# EAGLE design BAM_Reference_R2_1 (EAGLE 6.6.0)
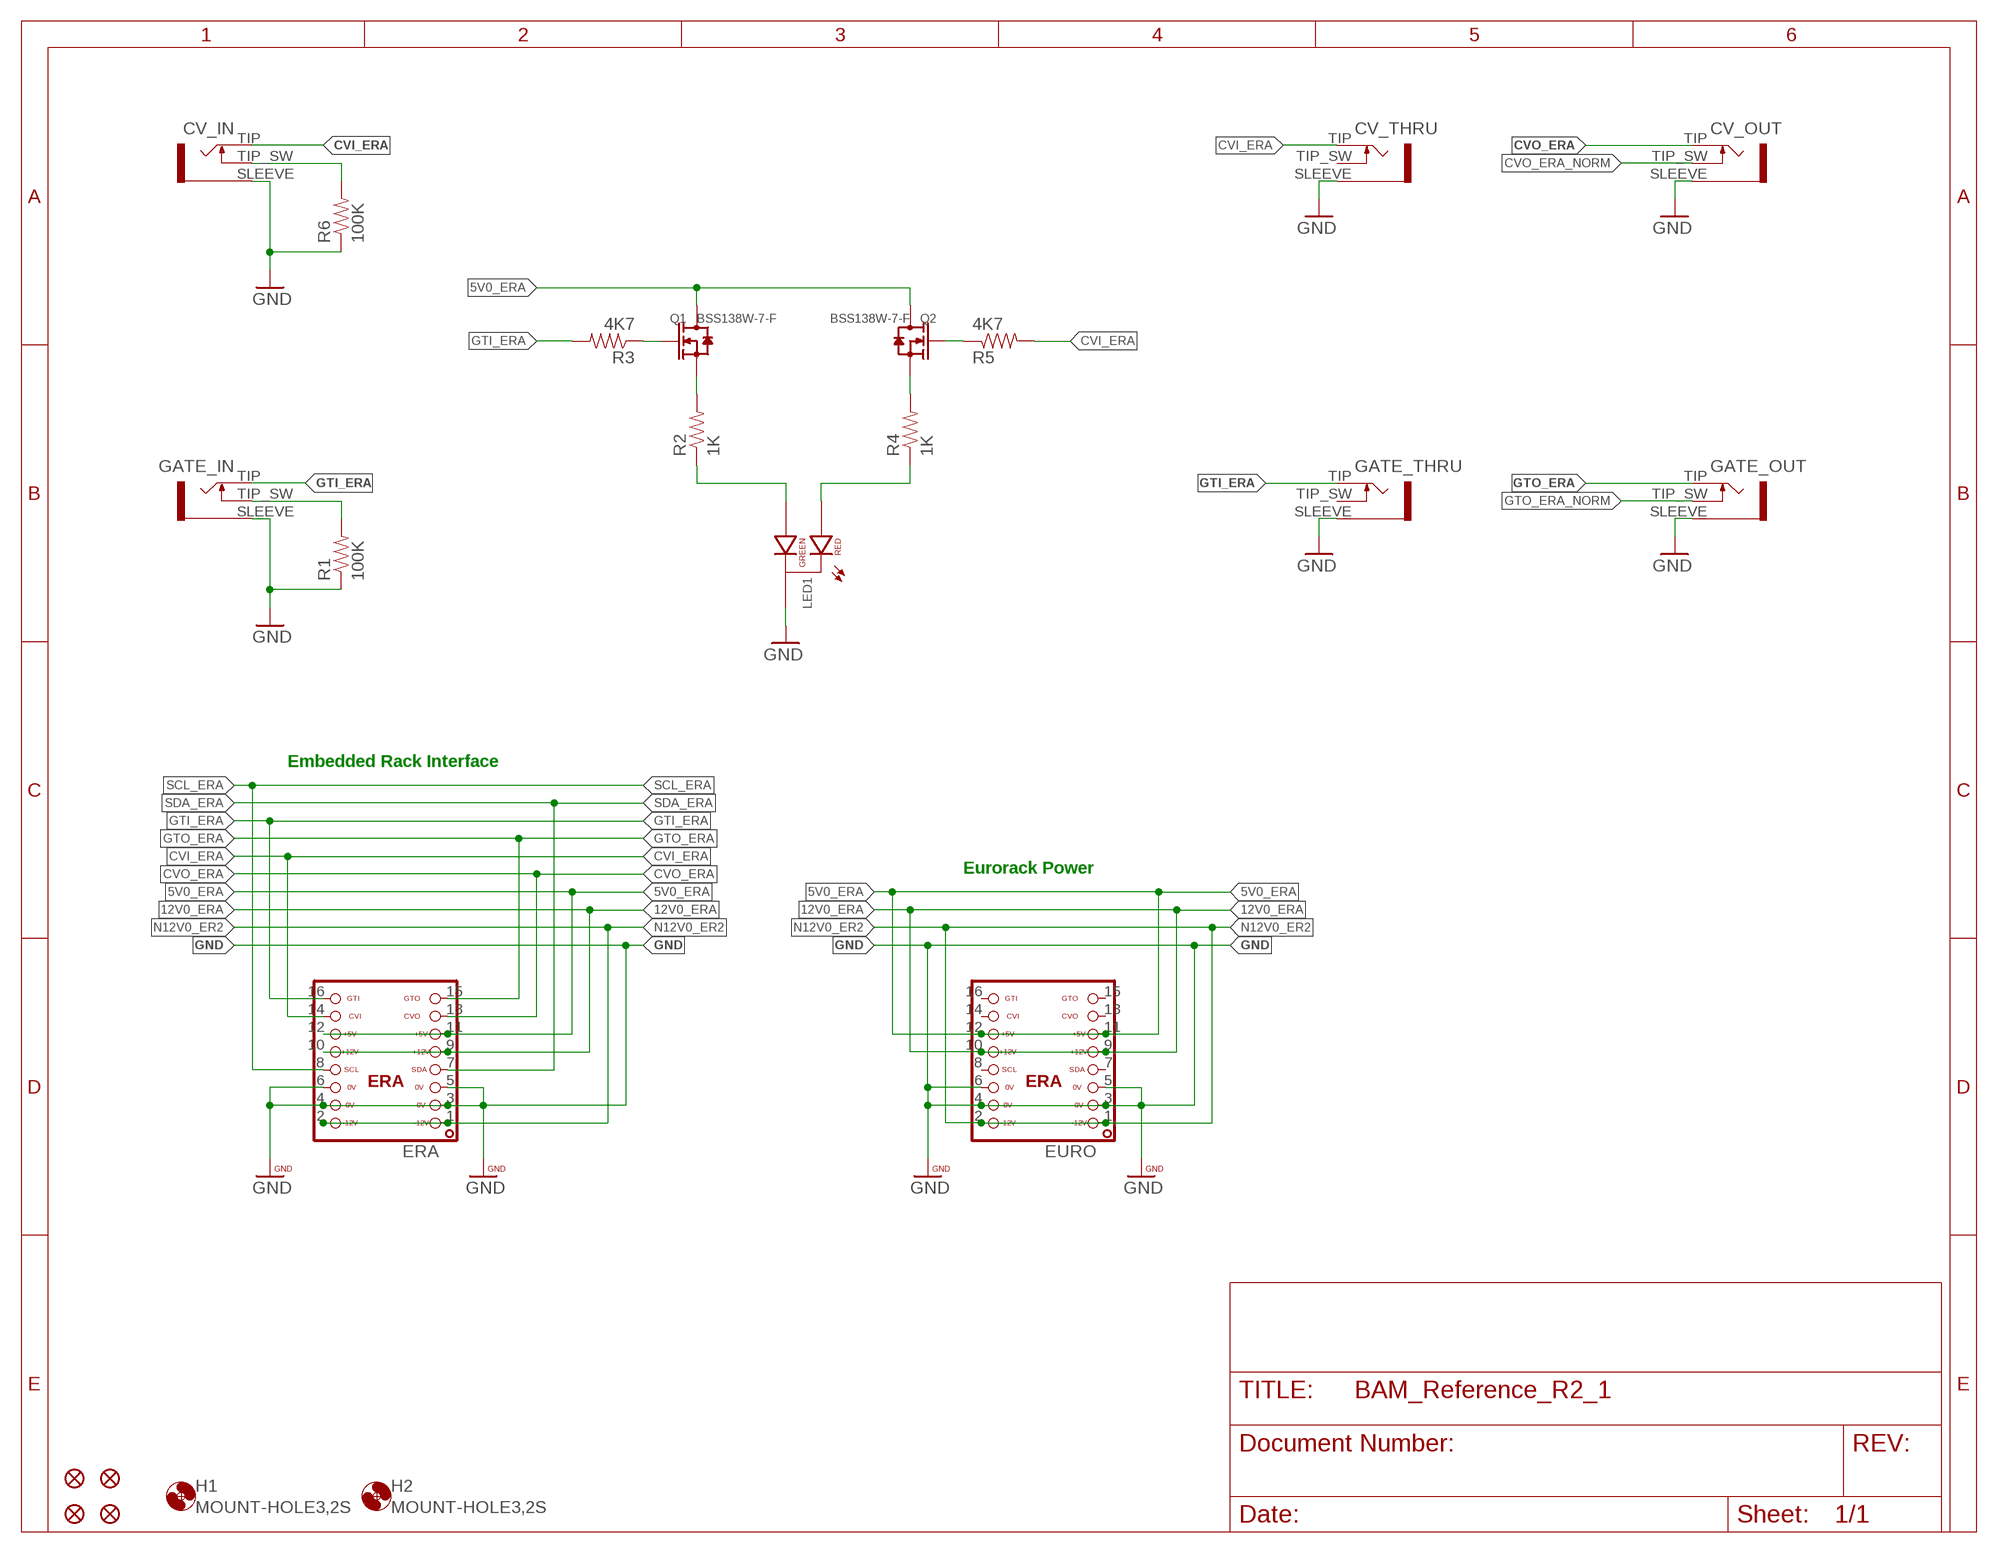
[diagram p0: schematic, sheet 1]

## Parts
CV_IN  JACK-3_5MM-MONO-SW-MJ_3502  [MJ-3502]
CV_OUT  JACK-3_5MM-MONO-SW-MJ_3502  [MJ-3502]
CV_THRU  JACK-3_5MM-MONO-SW-MJ_3502  [MJ-3502]
ERA  ERA-SHROUD  [ERA]
EURO  ERA-SHROUD  [ERA]
FID1  FIDUCIALUFIDUCIAL  [MICRO-FIDUCIAL]
FID2  FIDUCIALUFIDUCIAL  [MICRO-FIDUCIAL]
FID3  FIDUCIALUFIDUCIAL  [MICRO-FIDUCIAL]
FID4  FIDUCIALUFIDUCIAL  [MICRO-FIDUCIAL]
GATE_IN  JACK-3_5MM-MONO-SW-MJ_3502  [MJ-3502]
GATE_OUT  JACK-3_5MM-MONO-SW-MJ_3502  [MJ-3502]
GATE_THRU  JACK-3_5MM-MONO-SW-MJ_3502  [MJ-3502]
H1  MOUNT-HOLE3,2S  [3,2,SMALL]
H2  MOUNT-HOLE3,2S  [3,2,SMALL]
LED1  LED-RG-CC-PTH-G18500  [LED-RG-PANEL]
Q1  BSS138W-7-F  SMD-MOSFET-N-CH-50V-200MA-BSS138W-7-F(SOT-23)  [SOT-23]
Q2  BSS138W-7-F  SMD-MOSFET-N-CH-50V-200MA-BSS138W-7-F(SOT-23)  [SOT-23]
R1  100K  RESISTOR0603  [0603-RES]
R2  1K  RESISTOR0603  [0603-RES]
R3  4K7  RESISTOR0603  [0603-RES]
R4  1K  RESISTOR0603  [0603-RES]
R5  4K7  RESISTOR0603  [0603-RES]
R6  100K  RESISTOR0603  [0603-RES]

## Nets
5V0_ERA: ERA.11 ERA.12 EURO.11 EURO.12 Q1.3(D) Q2.3(D)
12V0_ERA: ERA.9 ERA.10 EURO.9 EURO.10
CVI_ERA: CV_IN.TIP CV_THRU.TIP ERA.14 R5.2
CVO_ERA: CV_OUT.TIP ERA.13
CVO_ERA_NORM: CV_OUT.TIP_SW
GND: CV_IN.SLEEVE CV_OUT.SLEEVE CV_THRU.SLEEVE ERA.3 ERA.4 ERA.5 ERA.6 EURO.3 EURO.4 EURO.5 EURO.6 GATE_IN.SLEEVE GATE_OUT.SLEEVE GATE_THRU.SLEEVE LED1.CC(CATHODE) R1.1 R6.1
GTI_ERA: ERA.16 GATE_IN.TIP GATE_THRU.TIP R3.2
GTO_ERA: ERA.15 GATE_OUT.TIP
GTO_ERA_NORM: GATE_OUT.TIP_SW
N12V0_ER2: ERA.1 ERA.2 EURO.1 EURO.2
N$1: LED1.GREEN(GREEN_CATHODE) R2.1
N$2: LED1.RED(RED_CATHODE) R4.1
N$3: Q1.1(G) R3.1
N$4: Q2.2(S) R4.2
N$5: Q2.1(G) R5.1
N$6: Q1.2(S) R2.2
N$7: CV_IN.TIP_SW R6.2
N$8: GATE_IN.TIP_SW R1.2
SCL_ERA: ERA.8
SDA_ERA: ERA.7
Unconnected: CV_THRU.TIP_SW EURO.7 EURO.8 EURO.13 EURO.14 EURO.15 EURO.16 GATE_THRU.TIP_SW

## Notes on the sheet
- Embedded Rack Interface
- Eurorack Power

## Library data of the parts
CV_IN GATE_IN = oXo_Connectors:JACK-3_5MM-MONO-SW: Jack, 3.5mm, RIght Angle, Though-Hole
CV_OUT CV_THRU GATE_OUT GATE_THRU = halcyonmod_Connectors:JACK-3_5MM-MONO-SW: Jack, 3.5mm, RIght Angle, Though-Hole
ERA EURO = ERA:ERA: EuroRack2 - Backplane Connector
FID1-FID4 = TSOC-ESP8266-BASE:FIDUCIAL: Fiducial Alignment Points Various fiducial points for machine vision alignment.
H1 H2 = oXo_Hardware:MOUNT-HOLE: MOUNTING HOLE with drill center marker
LED1 = halcyonmod_Optoelectronics:LED-RG-CC-PTH: LED Red/Green Common Cathode Pin Through Hole
Q1 Q2 = Seeed-Transistor-2016:SMD-MOSFET-N-CH-50V-200MA-BSS138W-7-F(SOT-23): 305030000; MPN: BSS138W-7-F
R1-R6 = halcyonmod_Passives:RESISTOR: Resistor Basic schematic elements and footprints for 0603, 1206, and PTH resistors.

## Net classes
1 power: width 0.254 mm, drill 0.356 mm, clearance 0.178 mm

## Board
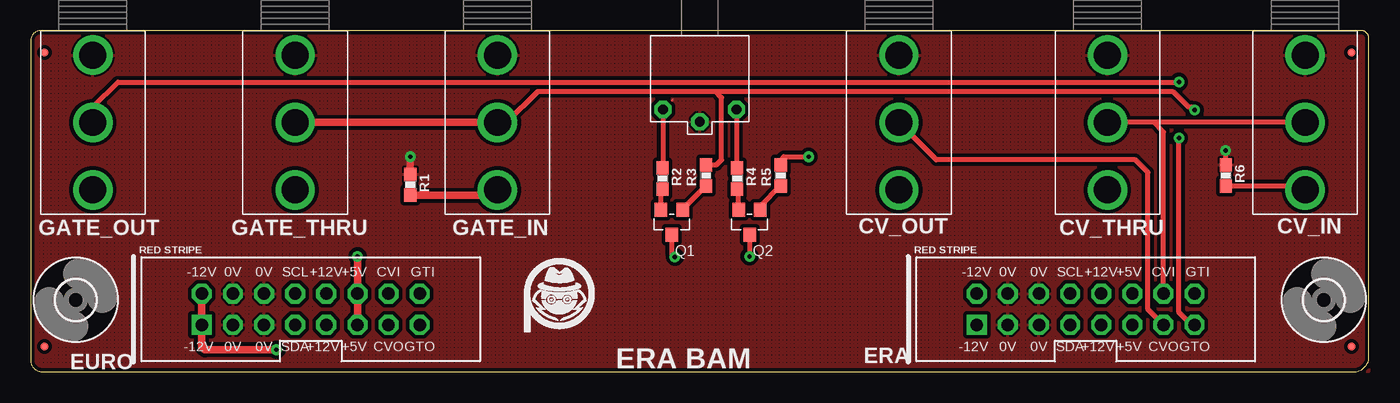
[diagram p1: board, top side]
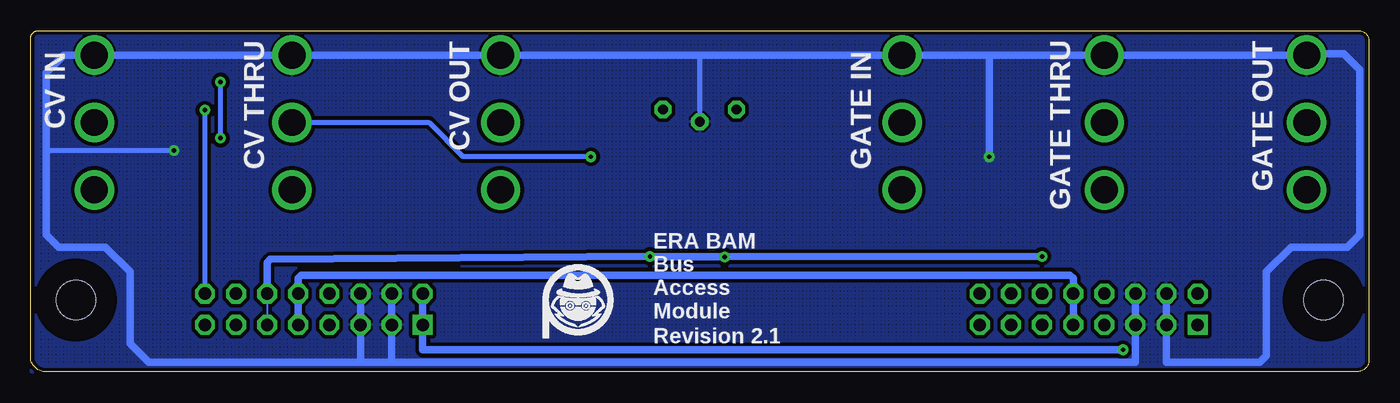
[diagram p2: board, bottom side, seen from below]

Size 109.22 x 27.84 mm. Coordinates in mm from the lower left corner, seen from the top.
Outline: 0.9,0.03 107.72,0.03 arc90 109.22,1.02 109.22,27.2 arc90 108.58,27.84 0.81,27.84 arc90 0,27.03 0,0.92 arc90 0.9,0.03
Copper layers (1*16): Top 0.035mm / dielectric 1.5mm / Bottom 0.035mm
Design rules "PatternAgents_7mil": minimum track width 7mil, minimum drill 14mil, track to track 7mil, track to pad 7mil, pad to pad 7mil, via to via 7mil, smd to smd 7mil, copper to edge 7mil, drill to drill 7mil, minimum pad ring 12mil, minimum via ring 10mil, stop-mask expansion 4mil, vias tented up to drill 25mil, thermal gap 7mil

### Footprints (pad centres in the part's own frame; a part is rotated, then mirrored left to right if it is on the bottom)
MJ-3502 = drill 2.2: SLEEVE -5.5,0; TIP 0,0; TIP_SW 5.5,0
ERA = drill 1.016 square: 1 -8.89,-1.27 | drill 1.016 octagon: 2 -8.89,1.27; 3 -6.35,-1.27; 4 -6.35,1.27; 5 -3.81,-1.27; 6 -3.81,1.27; 7 -1.27,-1.27; 8 -1.27,1.27; 9 1.27,-1.27; 10 1.27,1.27; 11 3.81,-1.27; 12 3.81,1.27; 13 6.35,-1.27; 14 6.35,1.27; 15 8.89,-1.27; 16 8.89,1.27
MICRO-FIDUCIAL = smd 0.635 x 0.635: 1 0,0
3,2,SMALL = hole 3.2: 0,0
LED-RG-PANEL = drill 0.8 octagon: CC 0,3.5; GREEN 3,2.5; RED -3,2.5
SOT-23 = smd 1.016 x 1.143: 1 -0.889,-1.016; 2 0.889,-1.016; 3 0,1.016
0603-RES = smd 1.1 x 1: 1 -0.85,0; 2 0.85,0

### Placement (x,y rotation side)
CV_IN  104.01,20.35 270 top
CV_OUT  70.87,20.35 270 top
CV_THRU  87.88,20.35 270 top
ERA  86.11,5.11 0 top
EURO  22.86,5.11 0 top
FID1  1.14,2.06 0 top
FID2  1.14,26.06 0 top
FID3  107.82,2.06 90 top
FID4  107.82,26.06 0 top
GATE_IN  38.1,20.35 270 top
GATE_OUT  5.08,20.35 270 top
GATE_THRU  21.59,20.35 270 top
H1  3.68,5.87 0 top
H2  105.54,5.87 0 top
LED1  54.61,23.9 180 top
Q1  52.32,12.22 180 top
Q2  58.67,12.22 180 top
R1  30.99,15.27 270 top
R2  51.56,15.77 270 top
R3  55.12,16.03 90 top
R4  57.66,15.77 270 top
R5  61.21,16.03 90 top
R6  97.54,16.03 270 top
U$1  PA_LOGO_SYMMED  [PA_LOGO_AGENT_MED_SYM]  43.18,5.87 0 top
U$2  PA_LOGO_SYMMED  [PA_LOGO_AGENT_MED_SYM]  64.52,5.36 0 bottom
U$48  BY_CC_SA_TEXTTEXT  [BY_CC_SA_TEXT]  20.83,-17.5 0 top  (outside the outline)

### Tracks (layer width: path | path; a pad name or v marks a point on that pad's centre or on a via)
5V0_ERA  (via drill 0.36)
  Top 0.406: Q2.3 v58.67,9.42 | Q1.3 52.32,9.63 v52.58,9.38
  Top 0.61: v26.67,9.42 EURO.12 EURO.11
  Bottom 0.178: ERA.12 ERA.11
  Bottom 0.61: ERA.12 89.92,8.92 89.66,9.17 v58.67,9.42 58.67,9.38 v52.58,9.38 v26.67,9.42
12V0_ERA
  Bottom 0.61: EURO.9 EURO.10 24.13,7.65 24.38,7.9 87.12,7.9 87.38,7.65 ERA.10 ERA.9
CVI_ERA  (via drill 0.36)
  Top 0.406: ERA.14 92.46,19.58 91.69,20.35 | 91.69,20.35 CV_THRU.TIP | CV_IN.TIP 91.69,20.35 | R5.2 61.38,17.04 61.38,17.46 61.47,17.55 v63.5,17.55
  Bottom 0.406: CV_THRU.TIP 76.71,20.35 73.91,17.55 v63.5,17.55
CVO_ERA
  Top 0.406: ERA.13 91.19,5.11 91.19,16.28 90.17,17.3 73.91,17.3 CV_OUT.TIP
GND  (via drill 0.36)
  Top 0.178: 52.32,22.12 52.41,22.21 | LED1.CC 54.86,20.6 54.86,20.47
  Top 0.406: R6.1 v97.54,18.06
  Top 0.61: R1.1 v30.99,17.55
  Bottom 0.406: v97.54,18.06 107.7,18.06 107.95,17.81 | LED1.CC 54.61,25.59 54.86,25.85
  Bottom 0.61: 30.99,25.85 GATE_IN.SLEEVE 54.86,25.85 CV_OUT.SLEEVE CV_THRU.SLEEVE CV_IN.SLEEVE 106.51,25.85 107.95,24.41 107.95,17.81 107.95,11.2 106.93,10.19 103.12,10.19 101.09,8.15 101.09,2.31 99.57,0.79 82.3,0.79 | 30.99,25.85 GATE_THRU.SLEEVE GATE_OUT.SLEEVE 4.99,25.93 2.03,25.93 0.76,24.66 0.76,11.2 1.78,10.19 6.35,10.19 8.38,8.15 8.38,1.3 8.89,0.79 16.51,0.79 EURO.3 EURO.4 | 79.76,0.79 19.05,0.79 EURO.5 EURO.6 | v30.99,17.55 30.99,25.85 | 79.76,0.79 ERA.3 ERA.4 | 79.76,0.79 82.3,0.79 | 82.3,0.79 ERA.5 ERA.6
  pour Top (isolate 0.305, hatched): 0,0.03 0,27.84 109.22,27.84 109.22,0.03
  pour Bottom (isolate 0.305, hatched): 0,0.03 0,27.84 109.22,27.84 109.22,0.03
GTI_ERA  (via drill 0.36)
  Top 0.406: GATE_IN.TIP 38.86,20.35 41.4,22.89 55.88,22.89 | 55.88,22.89 93.22,22.89 94.49,21.62 94.74,21.62 v95,21.36 | R3.2 55.97,16.88 56.39,17.3 56.39,22.38 55.88,22.89
  Top 0.61: GATE_THRU.TIP GATE_IN.TIP
  Bottom 0.406: v95,21.36 ERA.16
GTO_ERA  (via drill 0.36)
  Top 0.178: 94.74,3.84 ERA.15
  Top 0.406: 94.74,3.84 93.73,4.85 v93.73,19.08 | GATE_OUT.TIP 5.08,21.62 7.11,23.65 v93.73,23.65
  Bottom 0.406: v93.73,19.08 v93.73,23.65
N12V0_ER2  (via drill 0.36)
  Top 0.61: EURO.2 EURO.1 13.97,2.06 14.22,1.8 v20.07,1.8
  Bottom 0.61: v20.07,1.8 77.22,1.8 ERA.1 ERA.2
N$1
  Top 0.406: LED1.GREEN 51.61,16.42 R2.1
N$2
  Top 0.406: LED1.RED 57.61,16.42 R4.1
N$3
  Top 0.406: Q1.1 53.21,13.27 R3.1
N$4
  Top 0.406: Q2.2 57.78,14.8 R4.2
N$5
  Top 0.406: Q2.1 59.56,13.53 R5.1
N$6
  Top 0.406: Q1.2 51.44,14.8 R2.2
N$7
  Top 0.406: R6.2 103.68,15.18 CV_IN.TIP_SW
N$8
  Top 0.61: R1.2 37.67,14.42 GATE_IN.TIP_SW

### Text on the board
tPlace: ERA BAM
bPlace: CV IN | CV OUT | GATE IN | CV THRU | GATE OUT | GATE THRU | ERA BAM / Bus / Access / Module | Revision 2.1